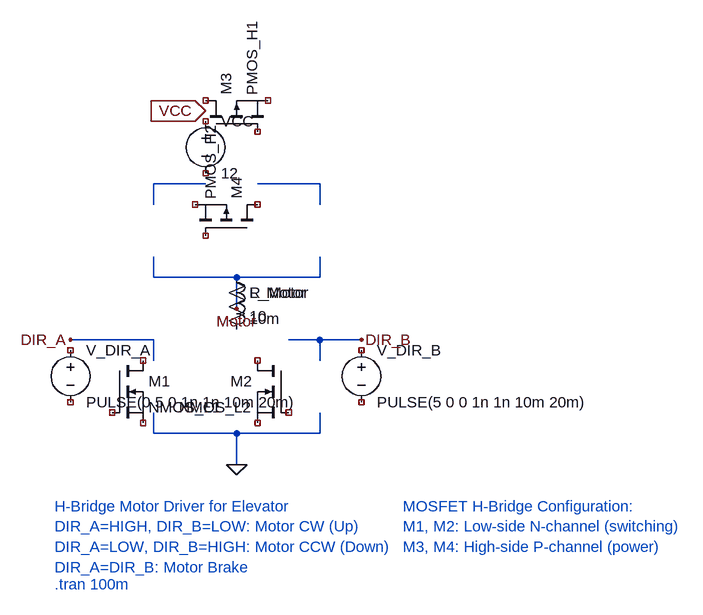
[diagram p0: schematic elevator_hbridge_motor_driver.asc]
elevator_hbridge_motor_driver.asc, the LTspice schematic file:
Version 4
SHEET 1 1200 800
WIRE 192 64 112 64
WIRE 368 64 272 64
WIRE 112 96 112 64
WIRE 368 96 368 64
WIRE 112 208 112 176
WIRE 240 208 112 208
WIRE 368 208 368 176
WIRE 368 208 240 208
WIRE 240 256 240 208
WIRE 48 304 -16 304
WIRE 112 304 48 304
WIRE 368 304 320 304
WIRE 432 304 368 304
WIRE 112 336 112 304
WIRE 368 336 368 304
WIRE 112 448 112 416
WIRE 240 448 112 448
WIRE 368 448 368 416
WIRE 368 448 240 448
WIRE 240 496 240 448
FLAG 240 496 0
FLAG 240 256 Motor
FLAG -16 304 DIR_A
FLAG 432 304 DIR_B
FLAG 192 -48 VCC
IOPIN 192 -48 In
SYMBOL nmos 48 336 R0
SYMATTR InstName M1
SYMATTR Value NMOS_L1
SYMATTR SpiceLine W=10u L=0.5u
SYMBOL nmos 320 336 M0
SYMATTR InstName M2
SYMATTR Value NMOS_L2
SYMATTR SpiceLine W=10u L=0.5u
SYMBOL pmos 192 -16 R270
SYMATTR InstName M3
SYMATTR Value PMOS_H1
SYMATTR SpiceLine W=20u L=0.5u
SYMBOL pmos 272 144 M270
SYMATTR InstName M4
SYMATTR Value PMOS_H2
SYMATTR SpiceLine W=20u L=0.5u
SYMBOL res 224 192 R0
SYMATTR InstName R_Motor
SYMATTR Value 10
SYMBOL ind 224 192 R0
SYMATTR InstName L_Motor
SYMATTR Value 10m
SYMBOL voltage 192 -48 R0
WINDOW 123 0 0 Left 0
WINDOW 39 0 0 Left 0
SYMATTR InstName VCC
SYMATTR Value 12
SYMBOL voltage -16 304 R0
WINDOW 123 0 0 Left 0
WINDOW 39 0 0 Left 0
SYMATTR InstName V_DIR_A
SYMATTR Value PULSE(0 5 0 1n 1n 10m 20m)
SYMBOL voltage 432 304 R0
WINDOW 123 0 0 Left 0
WINDOW 39 0 0 Left 0
SYMATTR InstName V_DIR_B
SYMATTR Value PULSE(5 0 0 1n 1n 10m 20m)
TEXT -40 560 Left 2 ;H-Bridge Motor Driver for Elevator\nDIR_A=HIGH, DIR_B=LOW: Motor CW (Up)\nDIR_A=LOW, DIR_B=HIGH: Motor CCW (Down)\nDIR_A=DIR_B: Motor Brake
TEXT -40 680 Left 2 ;.tran 100m
TEXT 496 560 Left 2 ;MOSFET H-Bridge Configuration:\nM1, M2: Low-side N-channel (switching)\nM3, M4: High-side P-channel (power)

The netlist it stands for:
* elevator_hbridge_motor_driver.asc
M1 NC_01 NC_02 NC_03 NC_03 NMOS_L1 W=10u L=0.5u
M2 NC_04 NC_05 NC_06 NC_06 NMOS_L2 W=10u L=0.5u
* M3: PMOS_H1 W=20u L=0.5u (symbol pmos not certain, pin order unknown); nets seen at it: 
M4 NC_10 NC_11 NC_12 NC_12 PMOS_H2 W=20u L=0.5u
R_Motor Motor P001 10
L_Motor Motor P001 10m
VCC NC_13 NC_14 12
V_DIR_A NC_15 NC_16 PULSE(0 5 0 1n 1n 10m 20m)
V_DIR_B NC_17 NC_18 PULSE(5 0 0 1n 1n 10m 20m)
.model NMOS NMOS
.model PMOS PMOS
.lib standard.mos
* H-Bridge Motor Driver for Elevator
* DIR_A=HIGH, DIR_B=LOW: Motor CW (Up)
* DIR_A=LOW, DIR_B=HIGH: Motor CCW (Down)
* DIR_A=DIR_B: Motor Brake
* .tran 100m
* MOSFET H-Bridge Configuration:
* M1, M2: Low-side N-channel (switching)
* M3, M4: High-side P-channel (power)
.backanno
.end